# Altium schematic sheet WindDir.SchDoc
size A4
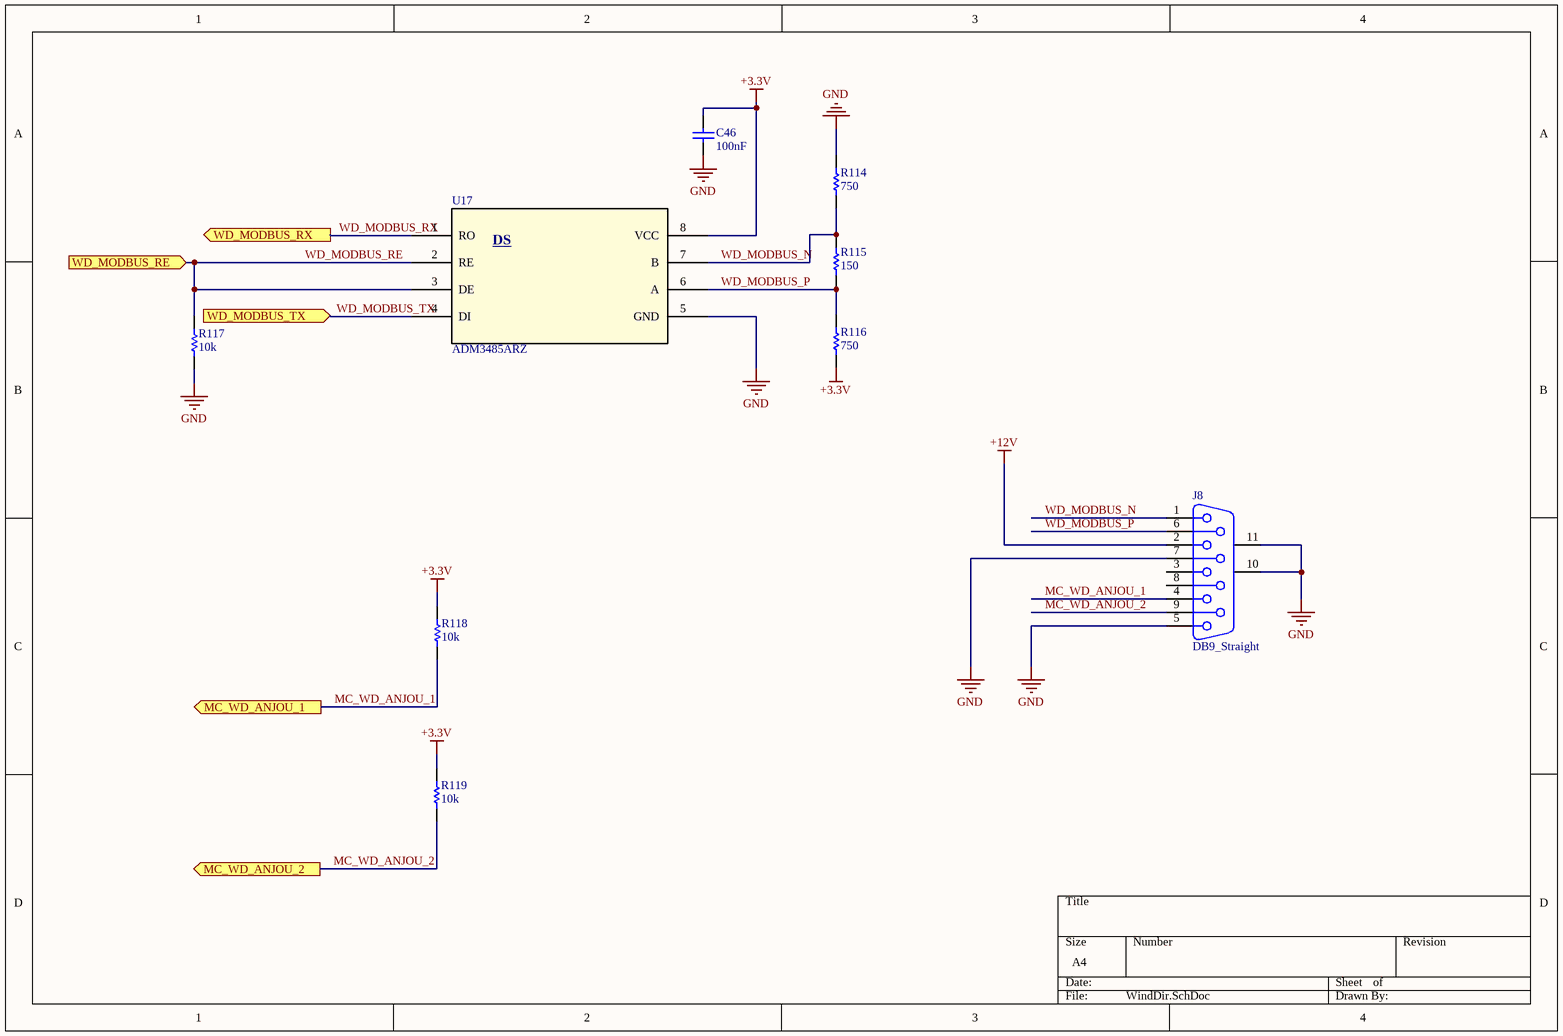
[diagram p0: WindDir.SchDoc]

## Parts
C46  value 100nF  [C-805]  (hidden comment: C-805)
J8  DB9_Straight  [DB9_Straight]
R114  value 750  [R-805]  (hidden comment: R-805)
R115  value 150  [R-805]  (hidden comment: R-805)
R116  value 750  [R-805]  (hidden comment: R-805)
R117  value 10k  [R-805]  (hidden comment: R-805)
R118  value 10k  [R-805]  (hidden comment: R-805)
R119  value 10k  [R-805]  (hidden comment: R-805)
U17  ADM3485ARZ  [R_8]

## Ports
MC_WD_ANJOU_1 (out), MC_WD_ANJOU_2 (out), WD_MODBUS_RE (in), WD_MODBUS_RX (out), WD_MODBUS_TX (in)

## Nets
+3.3V: C46.2 R116.1 R118.2 R119.2 U17.8(VCC)
+12V: J8.2
GND: C46.1 J8.5 J8.7 J8.10(MH1) J8.11(MH2) R114.2 R117.1 U17.5(GND)
MC_WD_ANJOU_1: J8.4 R118.1 ; port MC_WD_ANJOU_1
MC_WD_ANJOU_2: J8.9 R119.1 ; port MC_WD_ANJOU_2
WD_MODBUS_N: J8.1 R114.1 R115.2 U17.7(B)
WD_MODBUS_P: J8.6 R115.1 R116.2 U17.6(A)
WD_MODBUS_RE: R117.2 U17.2(RE) U17.3(DE) ; port WD_MODBUS_RE
WD_MODBUS_RX: U17.1(RO) ; port WD_MODBUS_RX
WD_MODBUS_TX: U17.4(DI) ; port WD_MODBUS_TX

Not connected (* = marked no-connect by the designer): J8 3 8

## Notes on the sheet
- (in symbol ADM3485ARZ) DS

## Library data of the parts
C46 = C-805: Capacitor; Published: 8-Jun-2000; LatestRevisionDate: 29-May-2009; LatestRevisionNote: IPC-7351 Footprint Added.; PackageReference: C1206; Publisher: Altium Limited; PackageDescription: Chip Capacitor
J8 = DB9_Straight: Receptacle Assembly, 9 Position, Right Angle; PackageDocument: O; Positions: 9; Published: 15-Jun-2001; LatestRevisionDate: 17-Jul-2002; LatestRevisionNote: Re-released for DXP Platform.; DatasheetDocument: 1-Sep-1999; PackageReference: 788750; Publisher: Altium Limited; Orientation: Right Angle; Gender: Receptacle
R114-R119 = R-805: Resistor
U17 = ADM3485ARZ: No Description Available; Vendor: Analog Devices Inc; Built_By: EMA_UL_Team; Manufacturer_Part_Number: ADM3485ARZ; Copyright: Copyright (C) 2018 Accelerated Designs. All rights reserved; RefDes: RefDes; Type: DEV; Value: Value